# EAGLE design AquaNode Model A (EAGLE 7.3.0)
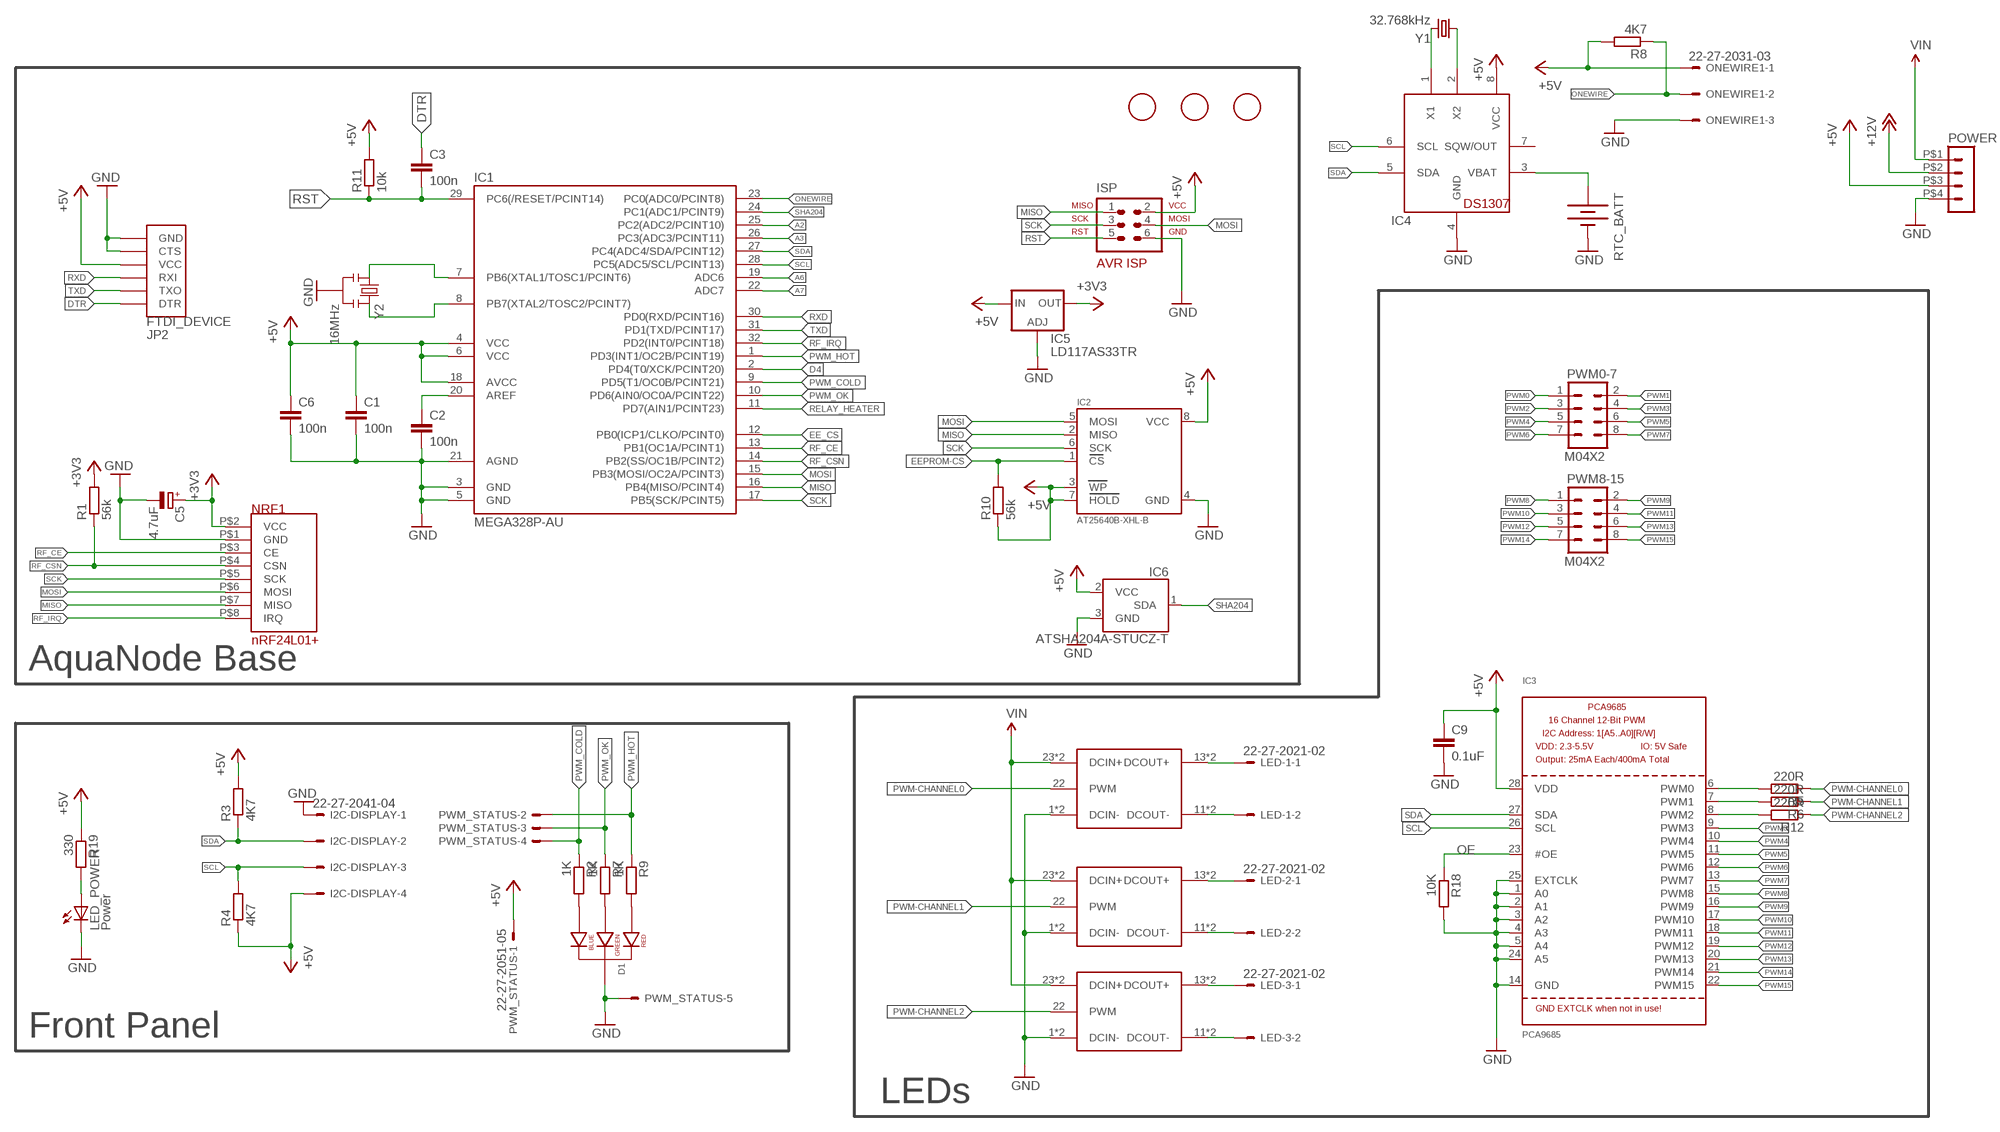
[diagram p0: schematic, sheet 1]

## Parts
C1  100n  C-EUC0603  [C0603]
C2  100n  C-EUC0603  [C0603]
C3  100n  C-EUC0603  [C0603]
C5  4.7uF  CPOL-EUE2.5-6  [E2,5-6]
C6  100n  C-EUC0603  [C0603]
C9  0.1uF  C-EUC0805  [C0805]
D1  LED-RGB-CC  LED-RGB-CC-THRUDIFFUSE  [LED-RGB-THRU]
DRV1  DLL-XXXH  LDD_H  [LDD_H]
DRV2  DLL-XXXH  LDD_H  [LDD_H]
DRV3  DLL-XXXH  LDD_H  [LDD_H]
FID1  FIDUCIAL  [FIDUCIAL_1MM]
FID2  FIDUCIAL  [FIDUCIAL_1MM]
FID3  FIDUCIAL  [FIDUCIAL_1MM]
I2C-DISPLAY  22-27-2041-04  [6410-04]
IC1  MEGA328P-AU  MEGA48/88/168-AU  [TQFP32-08]
IC2  AT25640B-XHL-B  EEPROM_SPI_AT25040ATSSOP  [TSSOP8-4.4MM]
IC3  PCA9685  [TSSOP28]
IC4  DS1307  DS1307SO08  [SO08]
IC5  LD117AS33TR  [SOT223]
IC6  ATSHA204A-STUCZ-T  ATSHA204-TSU  [SOT23-3]
ISP  ISP  AVR-ISP-6VERT  [AVR-ISP-6]
JP2  FTDI_DEVICE  [FTDI_DEVICE_SIDE]
LED-1  22-27-2021-02  [6410-02]
LED-2  22-27-2021-02  [6410-02]
LED-3  22-27-2021-02  [6410-02]
LED_POWER  Power  LED3MM  [LED3MM]
NRF1  NRF24L01+.EBAY  [NRF24L01+.EBAY]
ONEWIRE1  22-27-2031-03  [6410-03]
POWER  HEADER_POS4_43045-0412  [43045-0412]
PWM0-7  M04X2  [2X4]
PWM8-15  M04X2  [2X4]
PWM_STATUS  22-27-2051-05  [6410-05]
R1  56k  R-EU_M0805  [M0805]
R2  1K  R-EU_M0805  [M0805]
R3  4K7  R-EU_M0805  [M0805]
R4  4K7  R-EU_M0805  [M0805]
R5  220R  R-EU_M0805  [M0805]
R6  220R  R-EU_M0805  [M0805]
R7  1K  R-EU_M0805  [M0805]
R8  4K7  R-EU_M0805  [M0805]
R9  1K  R-EU_M0805  [M0805]
R10  56k  R-EU_M0805  [M0805]
R11  10k  R-EU_R0603  [R0603]
R12  220R  R-EU_M0805  [M0805]
R18  10K  R-EU_M0805  [M0805]
R19  330  R-EU_M0805  [M0805]
RTC_BATT  BATTERY20SMD  [BATTCON_20MM]
Y1  32.768kHz  CRYSTAL32-SMD  [CRYSTAL-32KHZ-SMD]
Y2  16MHz  RESONATORPTH  [RESONATOR-PTH]

## Nets
+3V3 [power1]: C5.+ IC5.4(OUT) NRF1.P$2(VCC) R1.2
+5V [power1]: C1.1 C6.1 C9.1 I2C-DISPLAY.4 IC1.4(VCC) IC1.6(VCC) IC1.18(AVCC) IC2.3(WP) IC2.7(HOLD) IC2.8(VCC) IC3.28(VDD) IC4.8(VCC) IC5.3(IN) IC6.2(VCC) ISP.2 JP2.P$4(VCC) ONEWIRE1.1 POWER.P$3 PWM_STATUS.1 R3.2 R4.1 R8.2 R10.1 R11.2 R19.1
+12V: POWER.P$2
A2: IC1.25(PC2(ADC2/PCINT10))
A3: IC1.26(PC3(ADC3/PCINT11))
A6: IC1.19(ADC6)
A7: IC1.22(ADC7)
D4: IC1.2(PD4(T0/XCK/PCINT20))
DTR: C3.1 JP2.P$1(DTR)
EE_CS: IC1.12(PB0(ICP1/CLKO/PCINT0))
EEPROM-CS: IC2.1(CS) R10.2
GND [power1]: C1.2 C2.2 C5.- C6.2 C9.2 D1.2(CATHODE) DRV1.1(DCIN-) DRV1.2(DCIN-) DRV2.1(DCIN-) DRV2.2(DCIN-) DRV3.1(DCIN-) DRV3.2(DCIN-) I2C-DISPLAY.1 IC1.3(GND) IC1.5(GND) IC1.21(AGND) IC2.4(GND) IC3.1(A0) IC3.2(A1) IC3.3(A2) IC3.4(A3) IC3.5(A4) IC3.14(GND) IC3.24(A5) IC3.25(EXTCLK) IC4.4(GND) IC5.1(ADJ) IC6.3(GND) ISP.6 JP2.P$5(CTS) JP2.P$6(GND) LED_POWER.K(C) NRF1.P$1(GND) ONEWIRE1.3 POWER.P$4 PWM_STATUS.5 R18.2 RTC_BATT.2(-) Y2.2
LED+1 [VIN]: DRV1.13(DCOUT+) DRV1.14(DCOUT+) LED-1.1
LED+2 [VIN]: DRV2.13(DCOUT+) DRV2.14(DCOUT+) LED-2.1
LED+3 [VIN]: DRV3.13(DCOUT+) DRV3.14(DCOUT+) LED-3.1
MISO: IC1.16(PB4(MISO/PCINT4)) IC2.2(MISO) ISP.1 NRF1.P$7(MISO)
MOSI: IC1.15(PB3(MOSI/OC2A/PCINT3)) IC2.5(MOSI) ISP.4 NRF1.P$6(MOSI)
N$1: D1.4(BLUE_CATHODE) R2.2
N$2: D1.3(GREEN_CATHODE) R7.2
N$3: D1.1(RED_CATHODE) R9.2
N$4: C2.1 IC1.20(AREF)
N$5 [power1]: IC4.3(VBAT) RTC_BATT.1(+)
N$6: IC4.1(X1) Y1.X2
N$7: IC4.2(X2) Y1.X1
N$8: IC1.7(PB6(XTAL1/TOSC1/PCINT6)) Y2.1
N$9: IC1.8(PB7(XTAL2/TOSC2/PCINT7)) Y2.3
N$15 [VIN]: DRV1.11(DCOUT-) DRV1.12(DCOUT-) LED-1.2
N$17 [VIN]: DRV2.11(DCOUT-) DRV2.12(DCOUT-) LED-2.2
N$19 [VIN]: DRV3.11(DCOUT-) DRV3.12(DCOUT-) LED-3.2
N$20: LED_POWER.A R19.2
OE: IC3.23(#OE) R18.1
ONEWIRE: IC1.23(PC0(ADC0/PCINT8)) ONEWIRE1.2 R8.1
PWM0: IC3.6(PWM0) PWM0-7.1 R5.2
PWM1: IC3.7(PWM1) PWM0-7.2 R6.2
PWM2: IC3.8(PWM2) PWM0-7.3 R12.2
PWM3: IC3.9(PWM3) PWM0-7.4
PWM4: IC3.10(PWM4) PWM0-7.5
PWM5: IC3.11(PWM5) PWM0-7.6
PWM6: IC3.12(PWM6) PWM0-7.7
PWM7: IC3.13(PWM7) PWM0-7.8
PWM8: IC3.15(PWM8) PWM8-15.1
PWM9: IC3.16(PWM9) PWM8-15.2
PWM10: IC3.17(PWM10) PWM8-15.3
PWM11: IC3.18(PWM11) PWM8-15.4
PWM12: IC3.19(PWM12) PWM8-15.5
PWM13: IC3.20(PWM13) PWM8-15.6
PWM14: IC3.21(PWM14) PWM8-15.7
PWM15: IC3.22(PWM15) PWM8-15.8
PWM-CHANNEL0: DRV1.22(PWM) R5.1
PWM-CHANNEL1: DRV2.22(PWM) R6.1
PWM-CHANNEL2: DRV3.22(PWM) R12.1
PWM_COLD: IC1.9(PD5(T1/OC0B/PCINT21)) PWM_STATUS.4 R2.1
PWM_HOT: IC1.1(PD3(INT1/OC2B/PCINT19)) PWM_STATUS.2 R9.1
PWM_OK: IC1.10(PD6(AIN0/OC0A/PCINT22)) PWM_STATUS.3 R7.1
RELAY_HEATER: IC1.11(PD7(AIN1/PCINT23))
RF_CE: IC1.13(PB1(OC1A/PCINT1)) NRF1.P$3(CE)
RF_CSN: IC1.14(PB2(SS/OC1B/PCINT2)) NRF1.P$4(CSN) R1.1
RF_IRQ: IC1.32(PD2(INT0/PCINT18)) NRF1.P$8(IRQ)
RST: C3.2 IC1.29(PC6(/RESET/PCINT14)) ISP.5 R11.1
RXD: IC1.30(PD0(RXD/PCINT16)) JP2.P$3(RXI)
SCK: IC1.17(PB5(SCK/PCINT5)) IC2.6(SCK) ISP.3 NRF1.P$5(SCK)
SCL: I2C-DISPLAY.3 IC1.28(PC5(ADC5/SCL/PCINT13)) IC3.26(SCL) IC4.6(SCL) R4.2
SDA: I2C-DISPLAY.2 IC1.27(PC4(ADC4/SDA/PCINT12)) IC3.27(SDA) IC4.5(SDA) R3.1
SHA204: IC1.24(PC1(ADC1/PCINT9)) IC6.1(SDA)
TXD: IC1.31(PD1(TXD/PCINT17)) JP2.P$2(TXO)
VIN [VIN]: DRV1.23(DCIN+) DRV1.24(DCIN+) DRV2.23(DCIN+) DRV2.24(DCIN+) DRV3.23(DCIN+) DRV3.24(DCIN+) POWER.P$1
Unconnected: IC4.7(SQW/OUT)

## Notes on the sheet
- AquaNode Base
- Front Panel
- LEDs

## Library data of the parts
C1-C3 C6 C9 = resistor:C-EU: CAPACITOR, European symbol
C5 = resistor:CPOL-EU: POLARIZED CAPACITOR, European symbol
D1 = SparkFun-LED:LED-RGB-CC-THRU: RGB Through-hole common cathode LED SparkFun Storefront: COM-00105 (Clear) COM-09264 (Diffuse); PROD_ID: DIO-09434
DRV1-DRV3 = meanwell_dcdc:LDD_H
FID1-FID3 = adafruit:FIDUCIAL: For use by pick and place machines to calibrate the vision/machine, 1mm By microbuilder.eu
I2C-DISPLAY = con-molex:22-?-04: CONNECTOR wire to board 2.54 mm (.1 inch) pitch header; OC_FARNELL: unknown; OC_NEWARK: unknown
IC1 = avr-7:MEGA48/88/168
IC2 = microbuilder:EEPROM_SPI_AT25040A: AT25010a/40a EEPROM SOIC8 AT25010a, 1K (128 x 8 bit) - Digikey: AT25010AN-10SU2.7-ND AT25040a, 4K (256 x 8 bit) - Digikey: AT25040AN-10SU1.8-ND TSSOP8 AT25010a, 1K (128 x 8 bit) - Digikey: AT25010A-10TU-1.8-ND AT25040a, 4K (256 x 8 bit) - Digikey: AT25040A-10TU-1.8-ND
IC3 = microbuilder:PCA9685: PCA9685 - 16 Channel 12-Bit I2C PWM Controller 5.0V tolerant 16 channel, 12-bit I2C PWM controller with 25mA per output (max. 400mA total) Digikey: 568-5931-1-ND
IC4 = TDK:DS1307: DS1307 Real time clock (RTC) with battery backup ability. Talk to it via i2c
IC5 = v-reg:LD117A?*: Low drop fixed and adjustable positive voltage regulators 1 A Source: http://www.st.com/stonline/products/literature/ds/7194/ld1117axx.pdf
IC6 = SparkFun-DigitalIC:ATSHA204: Atmel ATSHA204 The Atmel ATSHA204 is an optimized authentication chip that includes a 4.5Kb EEPROM. This array can be used for storage of keys, miscellaneous read/write, read-only, password or secret data, and consumption tracking. Access to the various sections of memory can be restricted in a variety of ways and then the configuration locked to prevent changes.
ISP = avr-7:AVR-ISP-6: AVR ISP-6 Serial Programming Header
JP2 = SparkFun-Connectors:FTDI_DEVICE: Connector which mates to FTDI basic or FTDI cable.
LED-1-LED-3 = con-molex:22-?-02: CONNECTOR wire to board 2.54 mm (.1 inch) pitch header; OC_FARNELL: unknown; OC_NEWARK: unknown
LED_POWER = led:LED: LED OSRAM: - CHIPLED LG R971, LG N971, LY N971, LG Q971, LY Q971, LO R971, LY R971 LH N974, LH R974 LS Q976, LO Q976, LY Q976 LO Q996 - Hyper CHIPLED LW Q18S LB Q993, LB Q99A, LB R99A - SideLED LS A670, LO A670, LY A670, LG A670, LP A670 LB A673, LV A673, LT A673, LW A673 LH A674 LY A675 LS A676, LA A676, LO A676, LY A676, LW A676 LS A679, LY A679, LG A679 - Hyper Micro SIDELED® LS Y876, LA Y876, LO Y876, LY Y876 LT Y87S - SmartLED LW L88C, LW L88S LB L89C, LB L89S, LG L890 LS L89K, LO L89K, LY L89K LS L896, LA L896, LO L896, LY L896 - TOPLED LS T670, LO T670, LY T670, LG T670, LP T670 LSG T670, LSP T670, LSY T670, LOP T670, LYG T670 LG T671, LOG T671, LSG T671 LB T673, LV T673, LT T673, LW T673 LH T674 LS T676, LA T676, LO T676, LY T676, LB T676, LH T676, LSB T676, LW T676 LB T67C, LV T67C, LT T67C, LS T67K, LO T67K, LY T67K, LW E67C LS E67B, LA E67B, LO E67B, LY E67B, LB E67C, LV E67C, LT E67C LW T67C LS T679, LY T679, LG T679 LS T770, LO T770, LY T770, LG T770, LP T770 LB T773, LV T773, LT T773, LW T773 LH T774 LS E675, LA E675, LY E675, LS T675 LS T776, LA T776, LO T776, LY T776, LB T776 LHGB T686 LT T68C, LB T68C - Hyper Mini TOPLED® LB M676 - Mini TOPLED Santana® LG M470 LS M47K, LO M47K, LY M47K Source: http://www.osram.convergy.de LUXEON: - LUMILED® LXK2-PW12-R00, LXK2-PW12-S00, LXK2-PW14-U00, LXK2-PW14-V00 LXK2-PM12-R00, LXK2-PM12-S00, LXK2-PM14-U00 LXK2-PE12-Q00, LXK2-PE12-R00, LXK2-PE12-S00, LXK2-PE14-T00, LXK2-PE14-U00 LXK2-PB12-K00, LXK2-PB12-L00, LXK2-PB12-M00, LXK2-PB14-N00, LXK2-PB14-P00, LXK2-PB14-Q00 LXK2-PR12-L00, LXK2-PR12-M00, LXK2-PR14-Q00, LXK2-PR14-R00 LXK2-PD12-Q00, LXK2-PD12-R00, LXK2-PD12-S00 LXK2-PH12-R00, LXK2-PH12-S00 LXK2-PL12-P00, LXK2-PL12-Q00, LXK2-PL12-R00 Source: www.luxeon.com KINGBRIGHT: KA-3528ASYC Source: www.kingbright.com
NRF1 = TDK:NRF24L01+.EBAY
ONEWIRE1 = con-molex:22-?-03: CONNECTOR wire to board 2.54 mm (.1 inch) pitch header; OC_FARNELL: unknown; OC_NEWARK: unknown
POWER = con-molex-micro-fit-3_0:HEADER_POS4_?: Molex - Micro-Fit 3.0 Series connector, 3.00mm (0.118") pitch header, 4 positions.
PWM0-7 PWM8-15 = SparkFun-Connectors:M04X2: .1" header, two rows of four.
PWM_STATUS = con-molex:22-?-05: CONNECTOR wire to board 2.54 mm (.1 inch) pitch header; OC_FARNELL: unknown; OC_NEWARK: unknown
R1-R12 R18 R19 = resistor:R-EU_: RESISTOR, European symbol
RTC_BATT = SparkFun-Electromechanical:BATTERY: Battery Holders Various common sizes : AA, AAA, 20mm coin cell and 12mm coin cell. 20MM_4LEGS, BATT-10373
Y1 = SparkFun-FreqCtrl:CRYSTAL: Various standard crystals. Proven footprints. Spark Fun Electronics SKU : COM-00534; PROD_ID: XTAL-07894
Y2 = SparkFun-FreqCtrl:RESONATOR: Resonator Small SMD resonator. Used, eg, on the Arduino Pro/ Pro Mini boards. 8MHz- XTAL-08895 16MHz- XTAL-08900

## Net classes
2 VIN: width 0.762 mm, clearance 0.381 mm

## Board
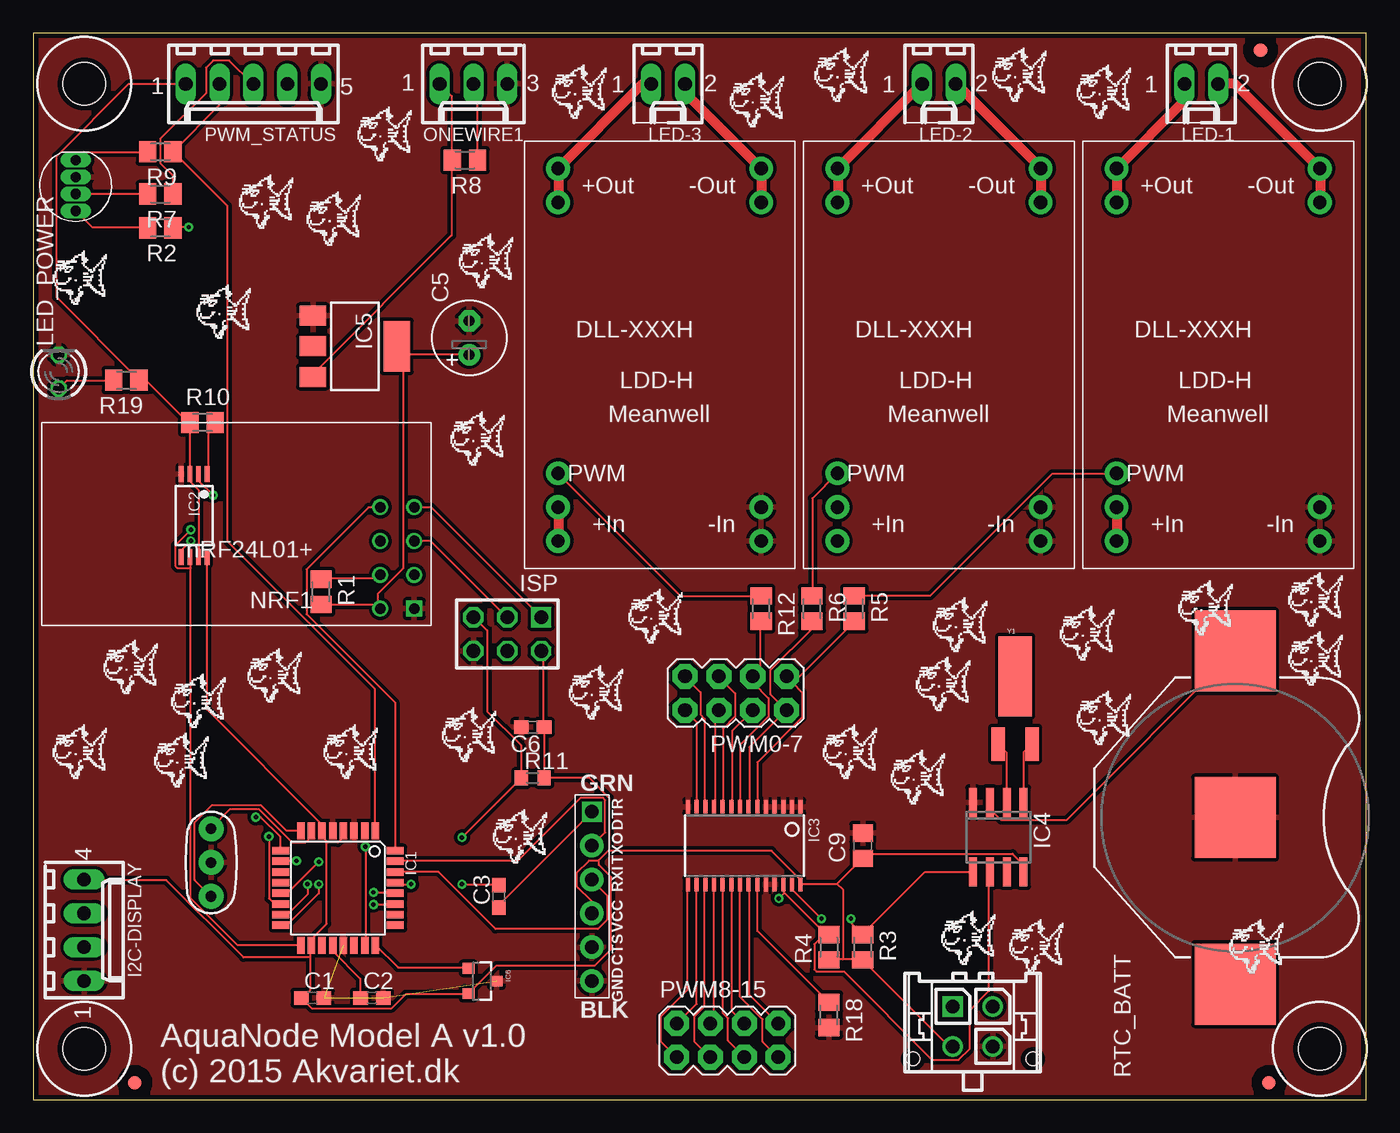
[diagram p1: board, top side]
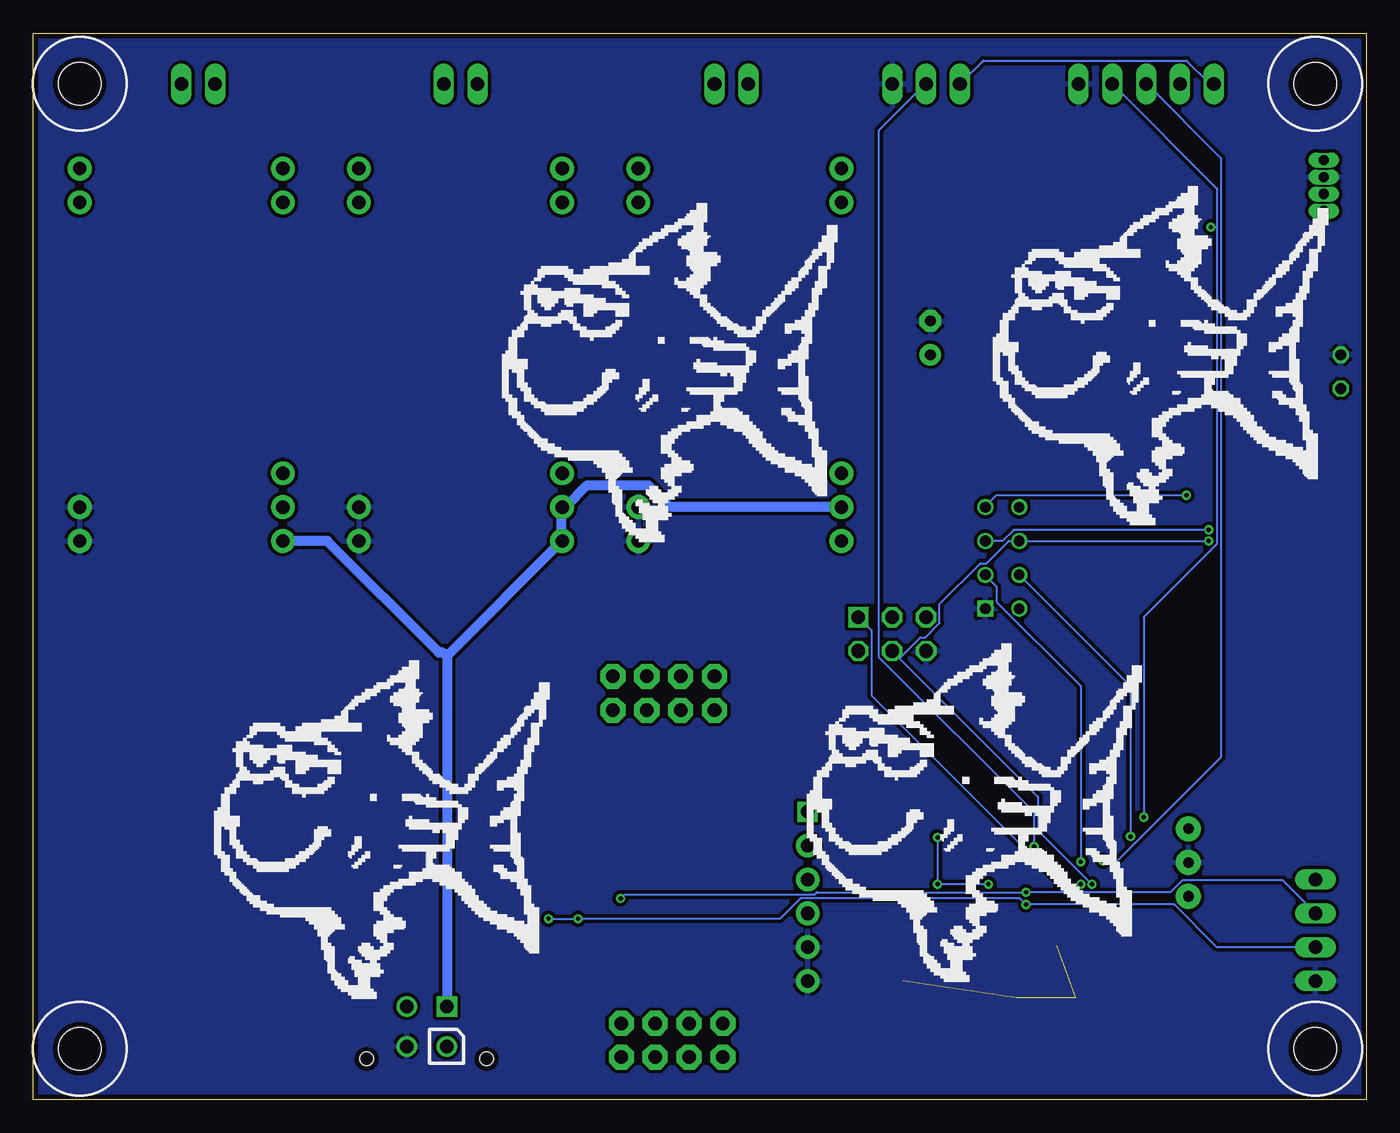
[diagram p2: board, bottom side, seen from below]

Size 100 x 80 mm. Coordinates in mm from the lower left corner, seen from the top.
Outline: 0,0 100,0 100,80 0,80 0,0
Copper layers (1*16): Top 0.0356mm / dielectric 1.5011mm / Bottom 0.0356mm
Design rules "OSH Park - LaenPCBOrder": minimum track width 6mil, minimum drill 13mil, track to track 6mil, track to pad 6mil, pad to pad 6mil, via to via 6mil, smd to smd 6mil, copper to edge 15mil, drill to drill 6mil, minimum pad ring 7mil, minimum via ring 7mil, stop-mask expansion 3mil, vias tented up to drill 0mil, thermal gap 10mil

### Footprints (pad centres in the part's own frame; a part is rotated, then mirrored left to right if it is on the bottom)
C0603 = smd 1.1 x 1: 1 -0.85,0; 2 0.85,0
E2,5-6 = drill 0.813 pad 1.6: + -1.27,0 | drill 0.813 pad 1.6 octagon: - 1.27,0
C0805 = smd 1.3 x 1.5: 1 -0.95,0; 2 0.95,0
LED-RGB-THRU = drill 0.762 pad 0.889 long: 1 1.905,0; 2 0.635,0; 3 -0.635,0; 4 -1.905,0
LDD_H = drill 1 pad 1.778: 1 -7.62,13.97; 2 -7.62,11.43; 11 -7.62,-11.43; 12 -7.62,-13.97; 13 7.62,-13.97; 14 7.62,-11.43; 22 7.62,8.89; 23 7.62,11.43; 24 7.62,13.97
FIDUCIAL_1MM = smd 1 x 1: 1 0,0
6410-04 = drill 1.016 long: 1 3.81,0; 2 1.27,0; 3 -1.27,0; 4 -3.81,0
TQFP32-08 = smd 1.27 x 0.559: 1 -4.293,2.8; 2 -4.293,2; 3 -4.293,1.2; 4 -4.293,0.4; 5 -4.293,-0.4; 6 -4.293,-1.2; 7 -4.293,-2; 8 -4.293,-2.8; 17 4.293,-2.8; 18 4.293,-2; 19 4.293,-1.2; 20 4.293,-0.4; 21 4.293,0.4; 22 4.293,1.2; 23 4.293,2; 24 4.293,2.8 | smd 0.559 x 1.27: 9 -2.8,-4.293; 10 -2,-4.293; 11 -1.2,-4.293; 12 -0.4,-4.293; 13 0.4,-4.293; 14 1.2,-4.293; 15 2,-4.293; 16 2.8,-4.293; 25 2.8,4.293; 26 2,4.293; 27 1.2,4.293; 28 0.4,4.293; 29 -0.4,4.293; 30 -1.2,4.293; 31 -2,4.293; 32 -2.8,4.293
TSSOP8-4.4MM = smd 1.2 x 0.35: 1 -3.1,0.975; 2 -3.1,0.325; 3 -3.1,-0.325; 4 -3.1,-0.975; 5 3.1,-0.975; 6 3.1,-0.325; 7 3.1,0.325; 8 3.1,0.975
TSSOP28 = smd 0.305 x 0.991: 1 -4.225,-2.918; 2 -3.575,-2.918; 3 -2.925,-2.918; 4 -2.275,-2.918; 5 -1.625,-2.918; 6 -0.975,-2.918; 7 -0.325,-2.918; 8 0.325,-2.918; 9 0.975,-2.918; 10 1.625,-2.918; 11 2.275,-2.918; 12 2.925,-2.918; 13 3.575,-2.918; 14 4.225,-2.918; 15 4.225,2.918; 16 3.575,2.918; 17 2.925,2.918; 18 2.275,2.918; 19 1.625,2.918; 20 0.975,2.918; 21 0.325,2.918; 22 -0.325,2.918; 23 -0.975,2.918; 24 -1.625,2.918; 25 -2.275,2.918; 26 -2.925,2.918; 27 -3.575,2.918; 28 -4.225,2.918
SO08 = smd 0.6 x 2.2: 1 -1.905,-2.6; 2 -0.635,-2.6; 3 0.635,-2.6; 4 1.905,-2.6; 5 1.905,2.6; 6 0.635,2.6; 7 -0.635,2.6; 8 -1.905,2.6
SOT223 = smd 1.5 x 2: 1 -2.3,-3.15; 2 0,-3.15; 3 2.3,-3.15 | smd 3.8 x 2: 4 0,3.15
SOT23-3 = smd 0.8 x 0.9: 1 -0.95,-1; 2 0.95,-1; 3 0,1.1
AVR-ISP-6 = drill 1.016 square: 1 -2.54,-1.27 | drill 1.016 octagon: 2 -2.54,1.27; 3 0,-1.27; 4 0,1.27; 5 2.54,-1.27; 6 2.54,1.27
FTDI_DEVICE_SIDE = drill 1 square: P$1 -6.35,0 | drill 1.016 pad 1.778: P$2 -3.81,0; P$3 -1.27,0; P$4 1.27,0; P$5 3.81,0; P$6 6.35,0
6410-02 = drill 1.016 long: 1 1.27,0; 2 -1.27,0
LED3MM = drill 0.813 octagon: A -1.27,0; K 1.27,0
NRF24L01+.EBAY = drill 0.8 square: P$1 -1.27,5.08 | drill 0.8: P$2 1.27,5.08; P$3 -1.27,2.54; P$4 1.27,2.54; P$5 -1.27,0; P$6 1.27,0; P$7 -1.27,-2.54; P$8 1.27,-2.54
6410-03 = drill 1.016 long: 1 2.54,0; 2 0,0; 3 -2.54,0
43045-0412 = drill 1.02 square: P$1 1.5,0 | drill 1.02: P$2 -1.5,0; P$3 1.5,3; P$4 -1.5,3 | hole 1.02: 4.5,3.94; -4.5,3.94
2X4 = drill 1.016 pad 1.88 octagon: 1 -3.81,-1.27; 2 -3.81,1.27; 3 -1.27,-1.27; 4 -1.27,1.27; 5 1.27,-1.27; 6 1.27,1.27; 7 3.81,-1.27; 8 3.81,1.27
6410-05 = drill 1.016 long: 1 5.08,0; 2 2.54,0; 3 0,0; 4 -2.54,0; 5 -5.08,0
M0805 = smd 1.3 x 1.6: 1 -0.95,0; 2 0.95,0
R0603 = smd 1 x 1.1: 1 -0.85,0; 2 0.85,0
BATTCON_20MM = smd 6.07 x 6.07: 1 -12.5,0; 2 0,0; 3 12.5,0
HOLE3.2 = hole 3.2: 0,0
CRYSTAL-32KHZ-SMD = smd 2.5 x 6: SHEILD 0,5.08 | smd 1 x 2.5: X1 -1.27,0; X2 1.27,0
RESONATOR-PTH = drill 0.8 pad 1.88: 1 -2.54,0; 2 0,0; 3 2.54,0

### Placement (x,y rotation side)
C1  20.95,7.62 0 top
C2  25.4,7.62 0 top
C3  34.92,15.24 90 top
C5  32.7,57.15 90 top
C6  37.47,27.94 180 top
C9  62.23,19.05 90 top
D1  3.17,68.58 90 top
DRV1  88.9,55.88 180 top
DRV2  67.94,55.88 180 top
DRV3  46.99,55.88 180 top
FID1  92.71,1.27 0 top
FID2  92.08,78.74 0 top
FID3  7.62,1.27 0 top
I2C-DISPLAY  3.81,12.7 270 top
IC1  22.86,15.88 270 top
IC2  12.06,43.81 270 top
IC3  53.34,19.05 180 top
IC4  72.39,19.68 180 top
IC5  24.13,56.52 270 top
IC6  33.66,8.89 270 top
ISP  35.56,34.92 180 top
JP2  41.91,15.24 270 top
LED-1  87.63,76.2 180 top
LED-2  67.94,76.2 180 top
LED-3  47.62,76.2 180 top
LED_POWER  1.91,54.61 90 top
NRF1  27.3,41.91 180 top
ONEWIRE1  33.02,76.2 180 top
POWER  70.48,6.99 180 top
PWM0-7  52.7,30.48 180 top
PWM8-15  52.07,4.45 0 top
PWM_STATUS  16.51,76.2 180 top
R1  21.59,38.1 270 top
R2  9.53,65.41 180 top
R3  62.23,11.43 270 top
R4  59.69,11.43 90 top
R5  61.59,36.83 270 top
R6  58.42,36.83 270 top
R7  9.53,67.94 180 top
R8  32.38,70.48 180 top
R9  9.53,71.12 180 top
R10  12.7,50.8 0 top
R11  37.47,24.13 0 top
R12  54.61,36.83 270 top
R18  59.69,6.35 270 top
R19  6.99,53.98 180 top
RTC_BATT  90.17,21.16 270 top
U$1  [THEFISH_SMALL]  23.5,26.04 0 top
U$2  [THEFISH_SMALL]  17.14,67.31 0 top
U$3  [THEFISH_SMALL]  41.91,30.48 0 top
U$4  [HOLE3.2]  3.81,3.81 0 top
U$5  [THEFISH_SMALL]  74.93,11.43 0 top
U$6  [HOLE3.2]  3.81,76.2 0 top
U$7  [HOLE3.2]  96.52,76.2 0 top
U$8  [THEFISH_SMALL]  78.74,34.92 0 top
U$9  [THEFISH]  41.91,8.89 0 bottom
U$10  [THEFISH]  86.36,7.62 0 bottom
U$11  [THEFISH]  64.77,41.91 0 bottom
U$12  [THEFISH]  27.94,43.18 0 bottom
U$13  [THEFISH_SMALL]  32.38,27.3 0 top
U$14  [THEFISH_SMALL]  3.17,61.59 0 top
U$15  [THEFISH_SMALL]  91.44,11.43 0 top
U$16  [THEFISH_SMALL]  22.23,66.04 0 top
U$17  [THEFISH_SMALL]  46.35,36.2 0 top
U$18  [THEFISH_SMALL]  67.94,31.11 0 top
U$19  [THEFISH_SMALL]  80.01,28.57 0 top
U$20  [THEFISH_SMALL]  40.64,75.56 0 top
U$21  [THEFISH_SMALL]  73.66,76.83 0 top
U$22  [THEFISH_SMALL]  53.98,74.93 0 top
U$23  [THEFISH_SMALL]  26.04,72.39 0 top
U$24  [THEFISH_SMALL]  13.97,59.05 0 top
U$25  [THEFISH_SMALL]  17.78,31.75 0 top
U$26  [THEFISH_SMALL]  66.04,24.13 0 top
U$27  [THEFISH_SMALL]  95.89,33.02 0 top
U$28  [THEFISH_SMALL]  6.99,32.38 0 top
U$29  [THEFISH_SMALL]  69.85,12.06 0 top
U$30  [THEFISH_SMALL]  60.96,26.04 0 top
U$31  [THEFISH_SMALL]  95.89,37.47 0 top
U$32  [THEFISH_SMALL]  87.63,36.83 0 top
U$33  [THEFISH_SMALL]  3.17,26.04 0 top
U$34  [THEFISH_SMALL]  69.22,35.56 0 top
U$35  [THEFISH_SMALL]  33.66,62.87 0 top
U$36  [THEFISH_SMALL]  36.2,19.68 0 top
U$37  [THEFISH_SMALL]  12.06,29.84 0 top
U$38  [THEFISH_SMALL]  33.02,49.53 0 top
U$39  [THEFISH_SMALL]  80.01,75.56 0 top
U$40  [THEFISH_SMALL]  60.33,76.83 0 top
U$41  [THEFISH_SMALL]  10.79,25.4 0 top
U$42  [HOLE3.2]  96.52,3.81 0 top
Y1  73.66,26.67 0 top
Y2  13.34,17.78 270 top

### Tracks (layer width: path | path; a pad name or v marks a point on that pad's centre or on a via)
+3V3
  Top 0.152: R1.2 21.64,37.11 25.76,37.11 NRF1.P$2 25.83,37.11 25.83,37.95 27.74,39.85 27.74,56.01 IC5.4 27.36,56.46 27.89,55.93 32.69,55.93 C5.+
+5V
  Top 0.152: ISP.2 38.1,33.6 38.25,33.45 38.25,27.96 C6.1 38.33,27.89 38.33,24.16 R11.2 38.41,24.16 41.68,24.16 43.2,22.63 43.2,18.75 43.17,18.71 | JP2.P$4 41.91,14.86 40.77,16 40.77,16.99 41.68,17.91 42.37,17.91 42.41,17.95 | 43.17,18.71 42.41,17.95 | 60.73,10.52 62.18,10.52 R3.2 62.26,10.44 68.66,4.04 68.96,4.04 POWER.P$3 | 60.73,10.52 59.74,10.52 R4.1 | 60.31,16.19 62.18,18.06 C9.1 62.26,18.14 62.56,18.44 73.46,18.44 74.3,17.6 IC4.8 | 60.31,16.19 60.27,16.15 57.61,16.15 IC3.28 57.61,16.23 57.61,16.46 55.4,18.67 43.2,18.67 43.17,18.71 | 60.73,10.52 60.73,15.77 60.31,16.19 | 31.39,70.48 31.39,75.29 ONEWIRE1.1 | 31.39,70.48 31.39,64.85 21.03,54.48 21.03,54.25 IC5.3 | 31.39,70.48 R8.2 | 22.06,19.32 22.1,19.28 22.86,19.28 23.24,19.66 23.24,20.12 IC1.4 | 22.06,19.32 21.72,19.66 21.72,20.12 IC1.6 21.64,20.19 21.64,20.65 13.03,29.26 13.03,40.62 IC2.8 13.03,40.69 12.42,40.69 IC2.7 12.42,40.77 12.42,45.72 11.81,46.33 11.81,46.86 IC2.3 11.73,46.94 11.73,50.75 R10.1 11.66,50.75 8.46,53.95 8,53.95 R19.1 7.92,54.03 1.75,60.2 1.75,70.79 7.16,76.2 PWM_STATUS.1 | 20.8,10.67 20.8,8.23 20.19,7.62 C1.1 20.12,7.62 20.88,6.86 26.9,6.86 27.96,7.92 32.61,7.92 IC6.2 32.69,8 34.75,10.06 42.14,10.06 43.36,11.28 43.36,16.69 42.44,17.6 42.44,17.91 42.41,17.95 | 20.8,10.67 20.8,11.58 IC1.18 20.88,11.58 20.88,12.04 22.02,13.18 22.02,19.28 22.06,19.32 | 20.8,10.67 15.77,10.67 9.98,16.46 3.81,16.46 I2C-DISPLAY.4
  Bottom 0.152: PWM_STATUS.1 11.73,76.2 13.49,77.95 28.73,77.95 ONEWIRE1.1
DTR
  Top 0.152: C3.1 34.98,14.4 34.98,14.63 41.91,21.57 JP2.P$1
EEPROM-CS
  Top 0.152: IC2.1 13.11,46.94 13.11,50.22 13.64,50.75 R10.2
GND  (3 unrouted)
  pour Bottom (isolate 0.254): -1.27,81.28 104.14,81.28 104.14,-1.27 -1.27,-1.27
  pour Top (isolate 0.254): -2.54,82.55 105.41,82.55 105.41,-2.54 -2.54,-2.54
LED+1
  Top 0.762: LED-1.1 86.33,76.2 86.33,74.91 DRV1.13 81.31,69.49 81.31,67.36 DRV1.14
LED+2
  Top 0.762: LED-2.1 DRV2.13 60.35,69.49 60.35,67.36 DRV2.14
LED+3
  Top 0.762: LED-3.1 45.72,76.2 DRV3.13 39.4,69.49 39.4,67.36 DRV3.14
MISO  (via drill 0.33)
  Top 0.152: v13.49,45.34 12.42,46.41 12.42,46.86 IC2.2 | v21.41,16.15 21.41,15.47 19.05,13.11 18.59,13.11 IC1.16 | ISP.1 29.87,44.42 28.57,44.42 NRF1.P$7
  Bottom 0.152: v13.49,45.34 27.74,45.34 28.57,44.5 NRF1.P$7 | v21.41,16.15 22.94,16.15 37.11,30.33 37.11,35.2 ISP.1
MOSI  (via drill 0.33)
  Top 0.152: v11.81,41.91 11.12,41.22 11.12,40.77 IC2.5 | v20.57,16.15 20.57,15.39 19.13,13.95 18.59,13.95 IC1.15
  Bottom 0.152: v11.81,41.91 NRF1.P$6 26.82,41.91 28.5,40.23 28.96,40.23 32,37.19 32,35.74 33.07,34.67 33.45,34.67 35.01,33.11 | v20.57,16.15 24.61,20.19 24.61,22.71 35.01,33.11 | ISP.4 35.01,33.11
N$1
  Top 0.152: R2.2 8.53,65.46 4.42,65.46 3.2,66.67 D1.4
N$2
  Top 0.152: R7.2 8.53,67.97 3.2,67.97 D1.3
N$3
  Top 0.152: R9.2 8.53,71.09 3.81,71.09 3.2,70.48 D1.1
N$4
  Top 0.152: C2.1 24.54,7.62 24.54,9.07 22.48,11.12 22.48,11.58 IC1.20
N$5
  Top 0.152: IC4.3 71.78,22.25 71.78,21.79 72.62,20.95 77.5,20.95 90.14,33.6 RTC_BATT.1
N$6
  Top 0.152: IC4.1 74.3,26.06 74.91,26.67 Y1.X2
N$7
  Top 0.152: Y1.X1 73,26.06 73,22.33 IC4.2
N$8
  Top 0.152: IC1.7 20.8,20.12 20.8,19.66 20.42,19.28 19.43,19.28 16.92,21.79 14.78,21.79 13.34,20.34 Y2.1
N$9
  Top 0.152: Y2.3 12.12,16.46 12.12,20.8 13.41,22.1 17.07,22.1 18.97,20.19 20.04,20.19 IC1.8
N$15
  Top 0.762: LED-1.2 90.14,76.2 96.47,69.88 DRV1.12 96.55,69.49 96.55,67.36 DRV1.11
N$17
  Top 0.762: LED-2.2 69.27,76.2 75.59,69.88 DRV2.12 75.59,69.49 75.59,67.36 DRV2.11
N$19
  Top 0.762: LED-3.2 48.92,76.2 48.92,75.51 54.56,69.88 DRV3.12 54.63,69.49 54.63,67.36 DRV3.11
N$20
  Top 0.152: LED_POWER.A 2.52,53.95 6.02,53.95 R19.2
OE
  Top 0.152: IC3.23 54.33,16.08 54.33,12.65 59.66,7.32 R18.1
ONEWIRE  (via drill 0.33)
  Top 0.152: v24.92,18.97 24.92,11.58 IC1.23 | R8.1 33.3,70.48 33.3,75.97 33.07,76.2 ONEWIRE1.2
  Bottom 0.152: v24.92,18.97 24.92,21.57 36.58,33.22 36.58,72.69 33.07,76.2 ONEWIRE1.2
PWM0
  Top 0.152: 57,31.24 56.54,31.7 PWM0-7.1 57,31.24 | 57,31.24 57.68,30.56 57.68,28.65 54.33,25.3 54.33,22.02 IC3.6 | 57,31.24 61.57,35.81 R5.2
PWM1
  Top 0.152: IC3.7 53.72,22.02 53.72,26.44 56.46,29.18 PWM0-7.2 55.32,30.4 55.32,32.23 58.37,35.28 58.37,35.81 R6.2
PWM2
  Top 0.152: IC3.8 53.03,22.02 53.03,26.59 55.17,28.73 55.17,30.1 54.03,31.24 54.03,31.7 PWM0-7.3 54.03,31.77 54.56,32.31 54.56,35.81 R12.2
PWM3
  Top 0.152: PWM0-7.4 52.43,27.66 52.43,22.02 IC3.9
PWM4
  Top 0.152: IC3.10 51.74,22.02 51.74,27.81 52.65,28.73 52.65,30.48 51.44,31.7 PWM0-7.5
PWM5
  Top 0.152: IC3.11 51.13,22.02 51.13,28.88 51.44,29.18 PWM0-7.6
PWM6
  Top 0.152: IC3.12 50.37,22.02 50.37,28.57 50.06,28.88 50.06,30.56 48.92,31.7 PWM0-7.7
PWM7
  Top 0.152: PWM0-7.8 49.76,28.35 49.76,22.02 IC3.13
PWM8
  Top 0.152: PWM8-15.1 47.09,4.34 47.09,6.25 49.07,8.23 49.07,16.08 IC3.15
PWM9
  Top 0.152: IC3.16 49.76,16.08 49.76,7.16 48.31,5.71 PWM8-15.2
PWM10
  Top 0.152: IC3.17 50.37,16.08 50.37,7.01 49.61,6.25 49.61,4.34 50.75,3.2 PWM8-15.3
PWM11
  Top 0.152: IC3.18 51.05,16.08 51.05,5.94 50.83,5.71 PWM8-15.4
PWM12
  Top 0.152: IC3.19 51.74,16.08 51.74,6.48 52.12,6.1 52.12,4.42 53.34,3.2 PWM8-15.5
PWM13
  Top 0.152: PWM8-15.6 52.43,6.63 52.43,16.08 IC3.20
PWM14
  Top 0.152: PWM8-15.7 54.71,4.34 54.71,6.02 53.03,7.7 53.03,16.08 IC3.21
PWM15
  Top 0.152: IC3.22 53.72,16.08 53.72,7.85 55.85,5.71 PWM8-15.8
PWM-CHANNEL0
  Top 0.152: R5.1 61.65,37.8 67.28,37.8 76.43,46.94 81.23,46.94 DRV1.22
PWM-CHANNEL1
  Top 0.152: DRV2.22 58.45,45.11 58.45,37.8 R6.1
PWM-CHANNEL2
  Top 0.152: R12.1 54.56,37.8 48.54,37.8 39.4,46.94 DRV3.22
PWM_COLD  (via drill 0.33)
  Top 0.152: v16.69,21.18 17.07,21.18 18.52,19.74 18.52,18.75 IC1.9 | v11.66,65.46 10.52,65.46 R2.1
  Bottom 0.152: v16.69,21.18 16.69,36.2 11.2,41.68 11.2,65.46 | 11.2,65.46 11.2,68.35 PWM_STATUS.4 | 11.2,65.46 v11.66,65.46
PWM_HOT
  Top 0.152: IC1.1 25.6,20.19 25.6,30.86 14.55,41.91 14.55,67.06 10.52,71.09 R9.1 10.52,71.17 13.95,74.6 13.95,76.2 PWM_STATUS.2
PWM_OK  (via drill 0.33)
  Top 0.152: v19.74,17.91 18.59,17.91 IC1.10 | R7.1 10.44,67.97 10.44,69.34 9.53,70.26 9.53,72.08 12.95,75.51 12.95,77.42 13.49,77.95 14.71,77.95 16.46,76.2 PWM_STATUS.3
  Bottom 0.152: v19.74,17.91 18.67,17.91 10.9,25.68 10.9,70.64 16.46,76.2 PWM_STATUS.3
RF_CE  (via drill 0.33)
  Top 0.152: v21.41,17.83 19.13,15.54 18.59,15.54 IC1.13
  Bottom 0.152: v21.41,17.83 21.41,31.01 27.74,37.34 27.74,38.48 28.57,39.32 NRF1.P$3
RF_CSN  (via drill 0.33)
  Top 0.152: v17.68,19.74 17.68,15.09 18.06,14.71 18.52,14.71 IC1.14 | NRF1.P$4 25.76,39.09 21.64,39.09 R1.1
  Bottom 0.152: v17.68,19.74 17.68,31.01 NRF1.P$4
RF_IRQ
  Top 0.152: IC1.32 27.13,18.75 27.13,29.79 20.5,36.42 20.5,39.78 25.15,44.42 25.98,44.42 NRF1.P$8
RST  (via drill 0.33)
  Top 0.152: v32.16,16.15 34.9,16.15 C3.2 | v28.35,16.15 27.28,16.15 27.2,16.23 IC1.29 | ISP.5 33.07,36.2 34.06,35.2 34.06,29.11 36.58,26.59 36.58,24.16 R11.1 36.58,24.08 v32.16,19.66
  Bottom 0.152: v28.35,16.15 v32.16,16.15 v32.16,19.66
RXD
  Top 0.152: IC1.30 27.2,17.07 30.4,17.07 34.67,12.8 42.37,12.8 43.05,13.49 43.05,15.32 41.91,16.46 JP2.P$3
SCK  (via drill 0.33)
  Top 0.152: NRF1.P$5 29.79,41.91 35.51,36.2 ISP.3 | 11.81,39.85 11.81,15.09 15.32,11.58 IC1.17 | 11.81,39.85 11.81,40.69 IC2.6 | v11.81,42.75 10.67,41.6 10.67,40.01 10.82,39.85 11.81,39.85
  Bottom 0.152: NRF1.P$5 27.28,41.91 26.44,42.75 v11.81,42.75
SCL  (via drill 0.33)
  Top 0.152: v25.53,15.54 27.13,15.54 IC1.28 | 56.35,15.51 59.44,12.42 59.66,12.42 R4.2 59.36,12.42 58.6,11.66 58.6,9.75 58.75,9.6 60.81,9.6 67.44,2.97 69.42,2.97 70.26,3.81 70.26,6.71 71.7,8.15 71.7,17.07 IC4.6 | 56.35,15.51 56.31,15.54 56.31,16.08 IC3.26 | 56.35,15.51 v55.93,15.09
  Bottom 0.152: I2C-DISPLAY.3 3.81,14.02 6.25,16.46 13.79,16.46 14.71,15.54 v25.53,15.54 41.22,15.54 41.38,15.39 55.63,15.39 v55.93,15.09
SDA  (via drill 0.33)
  Top 0.152: v59.13,13.56 56.92,15.77 56.92,16.08 IC3.27 | v61.34,13.56 61.34,13.26 62.18,12.42 R3.1 62.26,12.42 66.9,17.07 70.48,17.07 IC4.5 | v25.53,14.63 27.13,14.63 IC1.27
  Bottom 0.152: v61.34,13.56 v59.13,13.56 43.97,13.56 42.44,15.09 25.98,15.09 v25.53,14.63 14.4,14.63 11.2,11.43 I2C-DISPLAY.2
SHA204
  Top 0.152: IC6.1 32.61,9.91 27.36,9.91 25.68,11.58 IC1.24
TXD
  Top 0.152: JP2.P$2 42.9,20.04 42.9,22.48 42.75,22.63 41.07,22.63 36.35,17.91 27.2,17.91 IC1.31
VIN
  Top 0.762: DRV1.24 81.31,41.91 81.31,44.42 DRV1.23 | DRV3.24 39.4,41.91 39.4,44.42 DRV3.23
  Bottom 0.762: 68.96,33.3 68.96,7.01 POWER.P$1 | 68.96,33.3 60.35,41.91 DRV2.24 60.35,42.22 60.35,44.42 DRV2.23 59.97,44.58 58.45,46.1 53.87,46.1 52.27,44.5 39.4,44.5 DRV3.23 | DRV1.24 77.95,41.91 69.57,33.53 69.27,33.53 68.96,33.3

### Text on the board
tNames: AquaNode Model A v1.0 / (c) 2015 Akvariet.dk